# Altium project v4.3 Embutida.PrjPcb
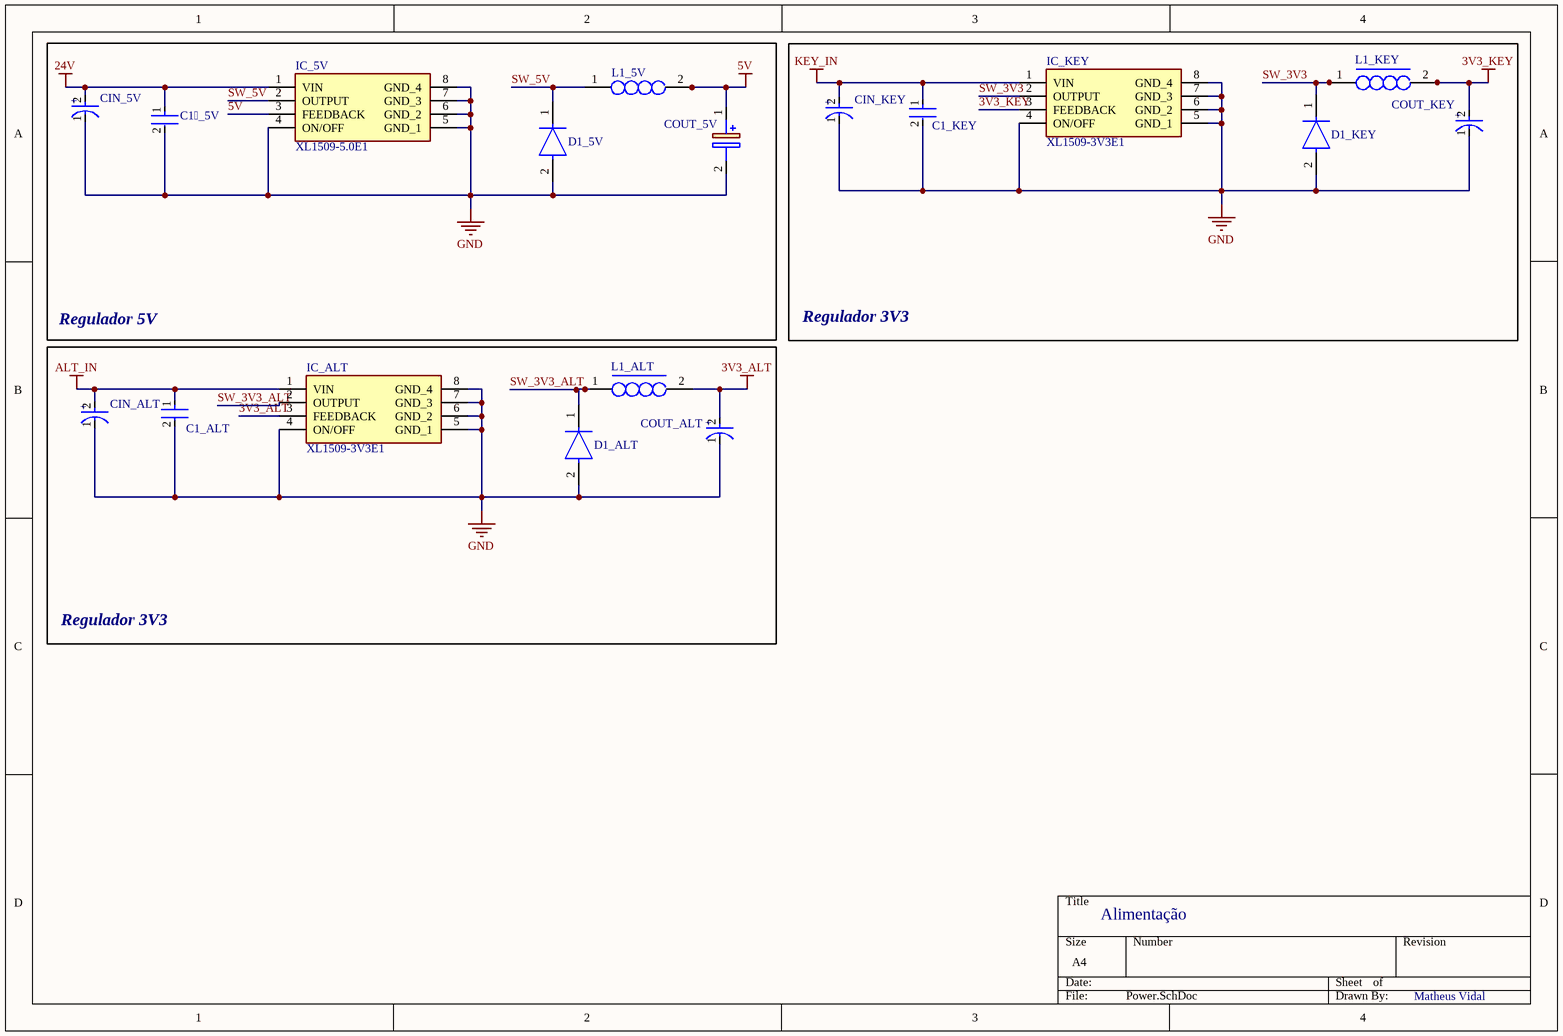
[diagram p0: Power.SchDoc]
2 sheets, 32 parts. Net scope: global (net labels, ports and power ports of the same name join across sheets).
Board file: v4.3.PcbDoc
Sheets:
  Power.SchDoc
  Comm.SchDoc

## Sheet Power.SchDoc
size A4; SheetNumber: 1; SheetTotal: 2

### Parts
C1__5V  08055C105KAT2A  [FP-0805-L_2_01_0_2-W_1_25-MFG]  (value not drawn)
C1_ALT  08055C105KAT2A  [FP-0805-L_2_01_0_2-W_1_25-MFG]  (value not drawn)
C1_KEY  08055C105KAT2A  [FP-0805-L_2_01_0_2-W_1_25-MFG]  (value not drawn)
CIN_5V  EEEFK1V471SP  [FP-FKSG-MFG]  (value not drawn)
CIN_ALT  EEEFK1V471SP  [FP-FKSG-MFG]  (value not drawn)
CIN_KEY  EEEFK1V471SP  [FP-FKSG-MFG]  (value not drawn)
COUT_5V  B40900B7277M000  [CAPAE1030X1050N]  (value not drawn)
COUT_ALT  MAL215099001E3  [FP-MAL2150-1010-MFG]  (value not drawn)
COUT_KEY  MAL215099001E3  [FP-MAL2150-1010-MFG]  (value not drawn)
D1_5V  1N5819HW1-7-F  [FP-SOD123F_Type_B-MFG]  (value not drawn)
D1_ALT  1N5819HW1-7-F  [FP-SOD123F_Type_B-MFG]  (value not drawn)
D1_KEY  1N5819HW1-7-F  [FP-SOD123F_Type_B-MFG]  (value not drawn)
IC_5V  XL1509-5.0E1  [SOIC127P600X175-8N]
IC_ALT  XL1509-3V3E1  [SOIC127P600X175-8N]
IC_KEY  XL1509-3V3E1  [SOIC127P600X175-8N]
L1_5V  SRR1260-680M  [INDPM125125X650N]  (value not drawn)
L1_ALT  SPM6545VT-470M-D  [SPM6545VT]  (value not drawn)
L1_KEY  SPM6545VT-470M-D  [SPM6545VT]  (value not drawn)

### Blocks framed on the sheet
Regulador 5V: C1__5V CIN_5V COUT_5V D1_5V IC_5V L1_5V
Regulador 3V3: C1_KEY CIN_KEY COUT_KEY D1_KEY IC_KEY L1_KEY

### Nets
3V3_ALT: COUT_ALT.2(A) IC_ALT.3(FEEDBACK) L1_ALT.2
3V3_KEY: COUT_KEY.2(A) IC_KEY.3(FEEDBACK) L1_KEY.2
5V: COUT_5V.1(+) IC_5V.3(FEEDBACK) L1_5V.2
24V: C1__5V.1 CIN_5V.2(A) IC_5V.1(VIN)
ALT_IN: C1_ALT.1 CIN_ALT.2(A) IC_ALT.1(VIN)
GND: C1__5V.2 C1_ALT.2 C1_KEY.2 CIN_5V.1(C) CIN_ALT.1(C) CIN_KEY.1(C) COUT_5V.2(-) COUT_ALT.1(C) COUT_KEY.1(C) D1_5V.2(A) D1_ALT.2(A) D1_KEY.2(A) IC_5V.4(ON/OFF) IC_5V.5(GND_1) IC_5V.6(GND_2) IC_5V.7(GND_3) IC_5V.8(GND_4) IC_ALT.4(ON/OFF) IC_ALT.5(GND_1) IC_ALT.6(GND_2) IC_ALT.7(GND_3) IC_ALT.8(GND_4) IC_KEY.4(ON/OFF) IC_KEY.5(GND_1) IC_KEY.6(GND_2) IC_KEY.7(GND_3) IC_KEY.8(GND_4)
KEY_IN: C1_KEY.1 CIN_KEY.2(A) IC_KEY.1(VIN)
SW_3V3: D1_KEY.1(C) IC_KEY.2(OUTPUT) L1_KEY.1
SW_3V3_ALT: D1_ALT.1(C) IC_ALT.2(OUTPUT) L1_ALT.1
SW_5V: D1_5V.1(C) IC_5V.2(OUTPUT) L1_5V.1

### Notes on the sheet
- Regulador 3V3
- Alimentação
- Matheus Vidal
- (in symbol CMP-00030-44434444-1) +
- (in symbol CMP-05427-000037-1) +

### Library data of the parts
C1__5V C1_ALT C1_KEY = CMP-2007-04696-2: General Purpose Ceramic Capacitor, 0805, 1uF, 10%, X7R, 15%, 50V; Dissipation Factor: 2.5%; Packaging: Tape and Reel; Lead Free: Lead Free; Contact Plating: Tin; Dielectric: X7R; Tolerance: 10%; Capacitance: 1uF; REACH SVHC: No SVHC; Voltage Rating (DC): 50V; Depth: 1.25mm; Voltage Rating: 50V; Radiation Hardening: No; Case Code (Metric): 2012; Width: 0.049inch; Package Quantity: 1; Mount: Surface Mount; Length: 2.01mm; Series: -; Thickness: 0.037inch; Max Operating Temperature: 125°C; RoHS Compliant: Yes; Termination: SMD/SMT; Case/Package: 0805; Min Operating Temperature: -55°C; Voltage: 50V; Case Code (Imperial): 0805
CIN_5V CIN_ALT CIN_KEY = CMP-05427-000037-1: CAP ALUM 470UF 20% 35V SMD; Ripple Current: 552.5mA; Life (Hours): 2000Hour; ESR (Equivalent Series Resistance): 80mR; Ripple Current (AC): 850mA; Polarity: Polar; Max Operating Temperature: 105°C; Height - Seated (Max): 0.413inch; Height: 10.2mm; Min Operating Temperature: -55°C; Voltage Rating: 35V; Voltage Rating (DC): 35V; Package Quantity: 500; Packaging: Cut Tape; Tolerance: 20%; Capacitance: 470uF; RoHS Compliant: Yes; Mount: Surface Mount; Case/Package: Radial; Diameter: 10mm
COUT_5V = B40900B7277M000: Capacitor Polarised; Manufacturer_Name: TDK; Datasheet Link: https://product.tdk.com/system/files/dam/doc/product/capacitor/aluminum-electrolytic/hybrid-polymer/data_sheet/20/30/db/aec/b40900.pdf; Height: 10.5mm; Manufacturer_Part_Number: B40900B7277M000; Mouser Part Number: 871-B40900B7277M000; Mouser Price/Stock: https://www.mouser.co.uk/ProductDetail/EPCOS-TDK/B40900B7277M000?qs=P1JMDcb91o5CBLRrUxE0Gw%3D%3D
COUT_ALT COUT_KEY = CMP-00030-44434444-1: MAL215099001E3 Aluminum Electrolytic Capacitor, 220 uF, 35 V, ± 20%, 2000 hours @ 105°C, Radial Can - SMD; Voltage Rating: 35V; Polarity: Polar; Impedance: 150mΩ; Ripple Current: 630mA; Life (Hours): 2500hours; Capacitance: 220µF; Height - Seated (Max): 10.4902mm; Packaging: Digi-Reel®; Radiation Hardening: No; Case/Package: Radial; Mount: Surface Mount; Schedule B: 8532220020, 8532220020; Voltage Rating (DC): 35V; Diameter: 10mm; Height: 10mm; RoHS: Compliant; Tolerance: 20%; NexarPartId: 44434444; Min Operating Temperature: -55°C; Max Operating Temperature: 105°C; REACH SVHC: Unknown; Ripple Current (AC): 630mA
D1_5V D1_ALT D1_KEY = CMP-12791-000028-1: DIODE SBR 40V 1A SOD123F; Manufacturer: Diodes Inc.; Max Junction Temp: +125°C; Capacitance: 30pF; Value: 30pF; Peak Reverse Current: 0.5mA; Max Surge Forward Current: 30A; ComponentLink2Description: Datasheet; Temperature: -55°C to +125°C; Lead Free: Yes; Package: SOD123F (Type B); Reverse Voltage: 40V; Device Class L2: Diodes; Manufacturer Part Number: 1N5819HW1-7-F; ComponentLink2URL: https://www.diodes.com/assets/Datasheets/1N5819HW1.pdf; Automotive: No; RoHS: TRUE; Height: 1.15mm; Digikey Description: DIODE SBR 40V 1A SOD123F; Max Repetitive Reverse Voltage: 40V; Forward Current: 1A; Footprint Url: https://www.diodes.com/assets/Package-Files/SOD123F%20(Type%20B).pdf; Temperature Range High: +125°C; Octopart: https://octopart.com/1n5819hw1-7-f-diodes+inc.-67250096; Mouser Description: Schottky Diodes & Rectifiers 1A SBR 40Vrrm 0.51Vf 0.5mA 28Vrms; Device Class L3: Rectifier Diodes; Ipc Land Pattern Name: SOD350180X98-2; Device Class L1: Discrete Semiconductors; Category: Diode; Temperature Range Low: -55°C
IC_5V IC_ALT IC_KEY = XL1509-5.0E1: Integrated Circuit; Manufacturer_Name: XLSEMI; Datasheet Link: https://datasheet.lcsc.com/szlcsc/XLSEMI-XL1509-5-0E1_C61063.pdf; Height: 1.75mm; Manufacturer_Part_Number: XL1509-5.0E1
L1_5V = SRR1260-680M: Inductor; Manufacturer_Name: Bourns; Datasheet Link: https://componentsearchengine.com/Datasheets/2/SRR1260-680M.pdf; Height: 6.5mm; Manufacturer_Part_Number: SRR1260-680M; Mouser Part Number: 652-SRR1260-680M; Mouser Price/Stock: https://www.mouser.co.uk/ProductDetail/Bourns/SRR1260-680M?qs=meVWcSOgEr6IqR5KoVnPsw%3D%3D; Arrow Part Number: SRR1260-680M; Arrow Price/Stock: https://www.arrow.com/en/products/srr1260-680m/bourns?utm_currency=USD&region=nac
L1_ALT L1_KEY = SPM6545VT-470M-D: Inductor (FeSi Core); Manufacturer_Name: TDK; Datasheet Link: https://product.tdk.com/system/files/dam/doc/product/inductor/inductor/smd/catalog/inductor_automotive_power_spm6545vt-d_en.pdf; Manufacturer_Part_Number: SPM6545VT-470M-D; Mouser Part Number: 810-SPM6545VT-470M-D; Mouser Price/Stock: https://www.mouser.co.uk/ProductDetail/TDK/SPM6545VT-470M-D?qs=vmHwEFxEFR%2FaEnepn6nn%2Fw%3D%3D; Arrow Part Number: SPM6545VT-470M-D; Arrow Price/Stock: https://www.arrow.com/en/products/spm6545vt-470m-d/tdk?region=nac

## Sheet Comm.SchDoc
size A4; SheetNumber: 2; SheetTotal: 2
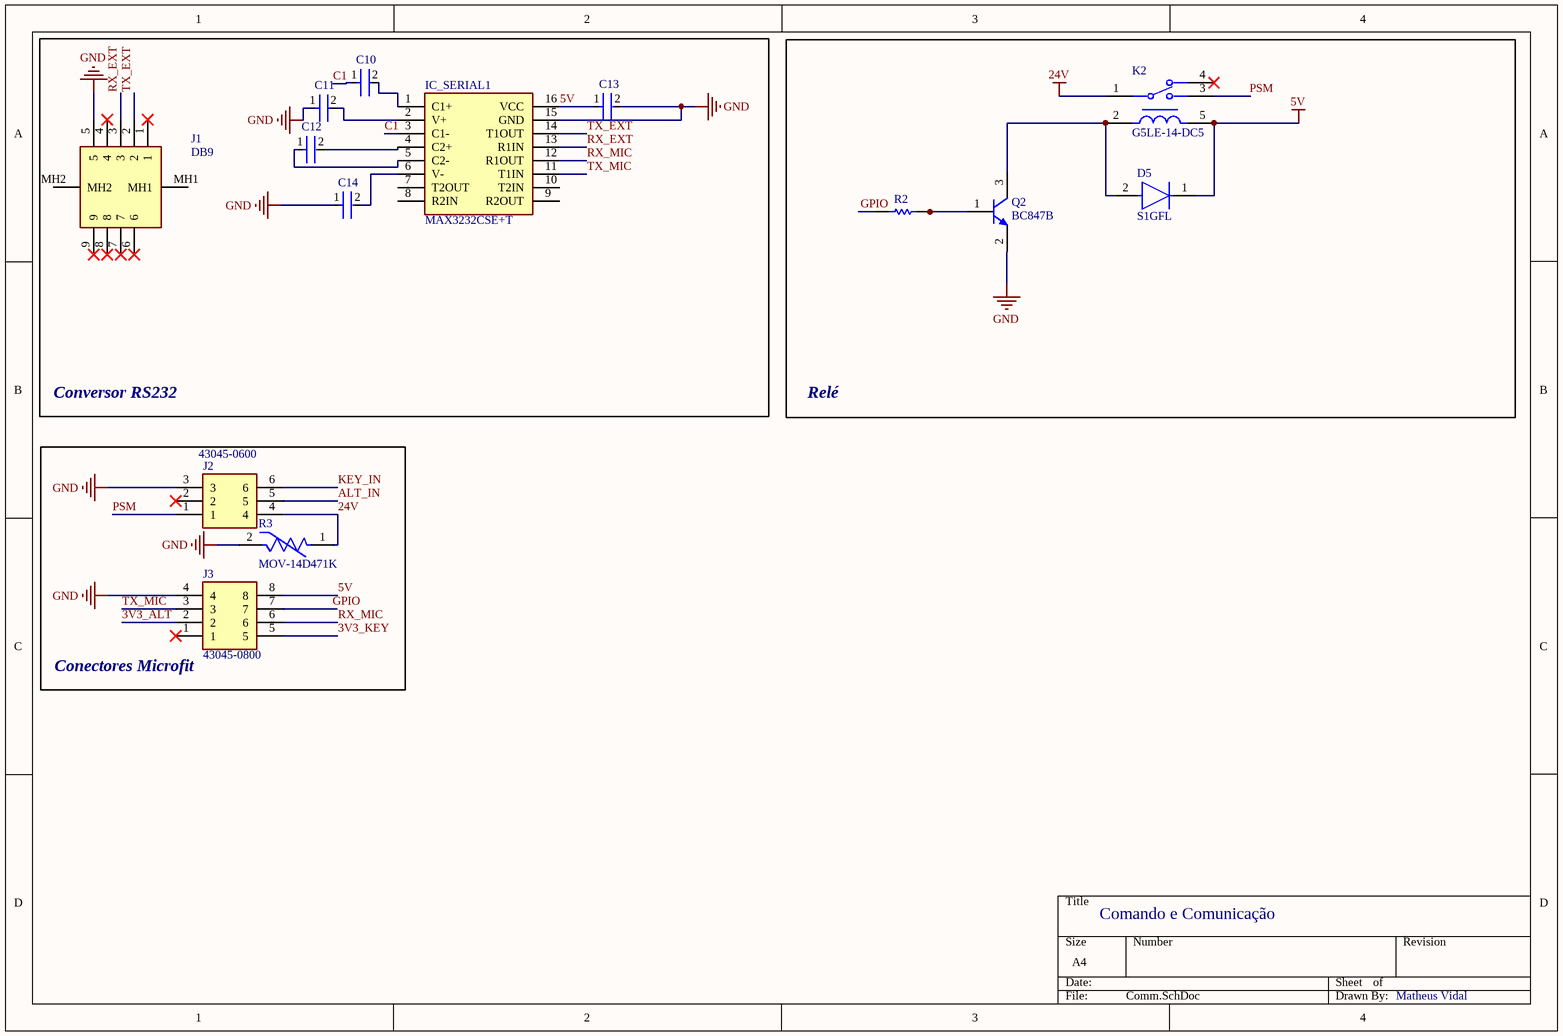
[diagram p1: Comm.SchDoc]

### Parts
C10  08055C104J4T2A  [FP-0805-L_2_01_0_2-W_1_25-MFG]  (value not drawn)
C11  08055C104J4T2A  [FP-0805-L_2_01_0_2-W_1_25-MFG]  (value not drawn)
C12  08055C104J4T2A  [FP-0805-L_2_01_0_2-W_1_25-MFG]  (value not drawn)
C13  08055C104J4T2A  [FP-0805-L_2_01_0_2-W_1_25-MFG]  (value not drawn)
C14  08055C104J4T2A  [FP-0805-L_2_01_0_2-W_1_25-MFG]  (value not drawn)
D5  S1GFL  [FP-425AD-MFG]
IC_SERIAL1  MAX3232CSE+T  [SOIC127P600X175-16N]
J1  DB9  [L77DFE09S1AMN]
J2  43045-0600  [43045-06(00,01,02,10)]
J3  43045-0800  [43045-08(00,01,02,10)]
K2  G5LE-14-DC5  [FP-G5LE-14-DC5-MFG]
Q2  BC847B  [INF-SOT23_M]
R2  10k  [RESC2013X50X30LL20T20]  (value not drawn)
R3  MOV-14D471K  [FP-MOV-14D471K-MFG]

### Blocks framed on the sheet
Conversor RS232: C10-C14 IC_SERIAL1 J1
Relé: D5 K2 Q2 R2
Conectores Microfit: J2 J3 R3

### Nets
3V3_ALT: J3.2
3V3_KEY: J3.5
5V: C13.1 D5.1(C) IC_SERIAL1.16(VCC) J3.8 K2.5
24V: J2.4 K2.1 R3.1
ALT_IN: J2.5
GND: C11.1 C13.2 C14.1 IC_SERIAL1.15(GND) J1.5 J2.3 J3.4 Q2.2(E) R3.2
KEY_IN: J2.6
C1: C10.1 IC_SERIAL1.3(C1-)
GPIO: J3.7 R2.2
PSM: J2.1 K2.3
RX_EXT: IC_SERIAL1.13(R1IN) J1.3
RX_MIC: IC_SERIAL1.12(R1OUT) J3.6
TX_EXT: IC_SERIAL1.14(T1OUT) J1.2
TX_MIC: IC_SERIAL1.11(T1IN) J3.3
NetC10_2: C10.2 IC_SERIAL1.1(C1+)
NetC11_2: C11.2 IC_SERIAL1.2(V+)
NetC12_1: C12.1 IC_SERIAL1.5(C2-)
NetC12_2: C12.2 IC_SERIAL1.4(C2+)
NetC14_2: C14.2 IC_SERIAL1.6(V-)
NetD5_2: D5.2(A) K2.2 Q2.3(C)
NetQ2_1: Q2.1(B) R2.1

Not connected (* = marked no-connect by the designer): IC_SERIAL1 7(T2OUT) 8(R2IN) 9(R2OUT) 10(T2IN); J1 1* 4* 6* 7* 8* 9* MH1 MH2; J2 2*; J3 1*; K2 4*

### Notes on the sheet
- Comando e Comunicação
- Matheus Vidal

### Library data of the parts
C10-C14 = CMP-2007-04725-2: Automotive Ceramic Capacitor, 0805, 100nF, 5%, X7R, 15%, 50V; Dissipation Factor: 2.5%; Construction: Flat; Length: 2.01mm; Series: -; Tolerance: 5%; Number of Pins: 2; Termination: SMD/SMT; Packaging: Tape and Reel; Case/Package: 0805; Mount: Surface Mount; Depth: 1.25mm; Voltage Rating (DC): 50V; Package Quantity: 4000; RoHS Compliant: Yes; Ratings: AEC-Q200; Voltage Rating: 50V; Contact Plating: Tin; Width: 0.049inch; Height: 0.94mm; Dielectric: X7R; Case Code (Metric): 2012; Min Operating Temperature: -55°C; Lead Free: Lead Free; Radiation Hardening: No; Capacitance: 100nF; Thickness: 0.037inch; Max Operating Temperature: 125°C; Case Code (Imperial): 0805
D5 = CMP-00278-84331274-1: S1GFL Rectifier Diode, 1 Phase, 1 Element, 1A, 400V V(RRM), Silicon; Manufacturer Lifecycle Status: ACTIVE, NOT REC; Reverse Recovery Time: 2µs; Peak Reverse Current: 1µA; Max Junction Temperature (Tj): 175°C; Capacitance: 4pF; Element Configuration: Single; Max Forward Surge Current (Ifsm): 30A; Mount: Surface Mount; Forward Current: 1A; Max Operating Temperature: 150°C; Schedule B: 8541100080, 8541100080; Max Repetitive Reverse Voltage (Vrrm): 400V; Reverse Voltage: 400V; Average Rectified Current: 1A; Lifecycle Status: NRND; RoHS: Compliant; Max Reverse Voltage (DC): 400V; Height: 1.08mm; NexarPartId: 84331274; Min Operating Temperature: -55°C; Weight: 27.6mg
IC_SERIAL1 = MAX3232CSE+T: Integrated Circuit; Manufacturer_Name: Analog Devices; Datasheet Link: https://datasheets.maximintegrated.com/en/ds/MAX3222-MAX3241.pdf; Height: 1.75mm; Manufacturer_Part_Number: MAX3232CSE+T; Mouser Part Number: 700-MAX3232CSET; Mouser Price/Stock: https://www.mouser.co.uk/ProductDetail/Analog-Devices-Maxim-Integrated/MAX3232CSE%2bT?qs=CDqwynd4ZNoTB%252BLjbeQ4Qg%3D%3D; Arrow Part Number: MAX3232CSE+T; Arrow Price/Stock: https://www.arrow.com/en/products/max3232cset/analog-devices?utm_currency=USD&region=nac
J1 = L77DFE09S1AMN: Connector; Manufacturer_Name: Amphenol Communications Solutions; Datasheet Link: https://cdn.amphenol-icc.com/media/wysiwyg/files/drawing/l77dfxxxs1amn.pdf; Height: 12.7mm; Manufacturer_Part_Number: L77DFE09S1AMN; Mouser Part Number: 523-L77DFE09S1AMN; Mouser Price/Stock: https://www.mouser.co.uk/ProductDetail/Amphenol-Commercial-Products/L77DFE09S1AMN?qs=mq7kV%2Fq8lk7eGEI8ax9brw%3D%3D
J2 = 43045-0600: Connector; Manufacturer_Name: Molex; Datasheet Link: https://www.molex.com/pdm_docs/sd/430450200_sd.pdf; Height: 9.9mm; Manufacturer_Part_Number: 43045-0600; Mouser Part Number: 538-43045-0600; Mouser Price/Stock: https://www.mouser.co.uk/ProductDetail/Molex/43045-0600?qs=mrPiglD9aYJ8CzJ%2FE2PNbw%3D%3D; Arrow Part Number: 43045-0600; Arrow Price/Stock: https://www.arrow.com/en/products/43045-0600/molex?region=nac
J3 = 43045-0800: Connector; Manufacturer_Name: Molex; Datasheet Link: https://www.molex.com/pdm_docs/sd/430450200_sd.pdf; Height: 8.77mm; Manufacturer_Part_Number: 43045-0800; Mouser Part Number: 538-43045-0800; Mouser Price/Stock: https://www.mouser.co.uk/ProductDetail/Molex/43045-0800?qs=MGlPTwjtJ4Z70Z3DbkGxKw%3D%3D
K2 = CMP-08822-000008-1: RELAY GEN PURPOSE SPDT 10A 5V; Manufacturer: Omron; Number Of Contacts: 1; Coil Type: Non-Latching; Coil Current: 79.4mA; Coil Power: 400mW; Description: General Purpose Relays Power PCB Relay SPDT Sealed 5VDC; Coil Resistance: 63Ω; Standoff Height: 0.5mm; Throw Configuration: SPDT; Ambient Temperature Range Low: -25°C; Package: 0; Device Class L2: Relays; Temperature Range High: +85°C; ComponentLink2Description: Datasheet; Octopart: https://octopart.com/g5le-14-dc5-omron-28829; Coil Voltage: 5V; Lead Free: Yes; Digikey Description: RELAY GEN PURPOSE SPDT 10A 5V; Device Class L1: Electromechanical; Device Class L3: Power Relays; ComponentLink2URL: https://omronfs.omron.com/en_US/ecb/products/pdf/en-g5le.pdf; Temperature: -25°C to +85°C; Ambient Temperature Range High: +85°C; RoHS: TRUE; Automotive: No; Height: 19mm; Category: Relay; Manufacturer Part Number: G5LE-14-DC5; Mouser Description: General Purpose Relays Power PCB Relay SPDT Sealed 5VDC; Current Rating: 10A; Switching Current: 10A; Temperature Range Low: -25°C
Q2 = CMP-1177-00042-1: NPN Silicon AF Transistor, 45 V VCEO, 100 mA IC, SOT23, Reel, Green; Manufacturer: Infineon; VEBO (max): 6Â V; ICBO (max): 15Â nA; VCBO (max): 50Â V; IBM (max): 200Â mA; Green: TRUE; Ptot (max): 330Â mW; fT (typ): 250Â MHz; IC (max): 100Â mA; VCEO (max): 45Â V; PackageDescription: 3-Pin Small Outline Transistor Package, 1.3 x 2.9 mm Body, 0.95 mm Pitch; ComponentLink3URL: http://www.infineon.com/dgdl/SOT23-Package_Overview.pdf?folderId=db3a30431936bc4b0119532290053c66&fileId=db3a30431936bc4b0119533468123c85; PackageVersion: Apr-08; Packing: Reel; ComponentLink3Description: Package Specification; ComponentLink2URL: http://www.infineon.com/dgdl/bc847series_bc848series_bc849series_bc850series.pdf?folderId=db3a304314dca389011541d30fa21656&fileId=db3a304314dca389011541d4630a1657; ComponentLink1URL: http://www.infineon.com/; ComponentLink2Description: Datasheet; Polarity: NPN; Mounting Technology: Surface Mount; PackageReference: SOT23; ICM (max): 200Â mA; ComponentLink1Description: Manufacturer URL; PartNumber: BC847B
R2 = CMP-2001-04896-1: Manufacturer: Vishay Dale; Part Number: CRCW08050000Z0EA
R3 = CMP-07402-000007-1: VARISTOR 470V 4.5KA DISC 14MM; Manufacturer: Bourns Inc.; Value: 516pF; Clamping Voltage: 775V; Esd Protec Present: true; Voltage Rating Ac: 300V; Clamping Current: 50A; Voltage Tolerance: 10%; Varistor Voltage: 423V; Voltage Rating Dc: 385V; Temperature Range High: +105°C; Device Class L3: unset; Category: Res; Package: Radial; Height: 20mm; Device Class L1: Circuit Protection; Temperature Range Low: -40°C; Lead Free: Yes; Automotive: No; Mouser Description: Varistors 470volts 14mm; RoHS: TRUE; Octopart: https://octopart.com/mov-14d471k-bourns-21388916; Device Class L2: Varistors; Manufacturer Part Number: MOV-14D471K; Digikey Description: VARISTOR 470V 4.5KA DISC 14MM; Temperature: -40°C to +105°C; Capacitance: 516pF; ComponentLink2Description: Datasheet; ComponentLink2URL: https://www.bourns.com/docs/product-datasheets/mov14d.pdf?sfvrsn=d6ed188_26

## Nets that join several sheets
3V3_ALT: Power (COUT_ALT.2 IC_ALT.3 L1_ALT.2), Comm (J3.2)
3V3_KEY: Power (COUT_KEY.2 IC_KEY.3 L1_KEY.2), Comm (J3.5)
5V: Power (COUT_5V.1 IC_5V.3 L1_5V.2), Comm (5 pins)
24V: Power (C1__5V.1 CIN_5V.2 IC_5V.1), Comm (J2.4 K2.1 R3.1)
ALT_IN: Power (C1_ALT.1 CIN_ALT.2 IC_ALT.1), Comm (J2.5)
GND: Power (27 pins), Comm (9 pins)
KEY_IN: Power (C1_KEY.1 CIN_KEY.2 IC_KEY.1), Comm (J2.6)